# Altium schematic sheet 01.SchDoc
size A4
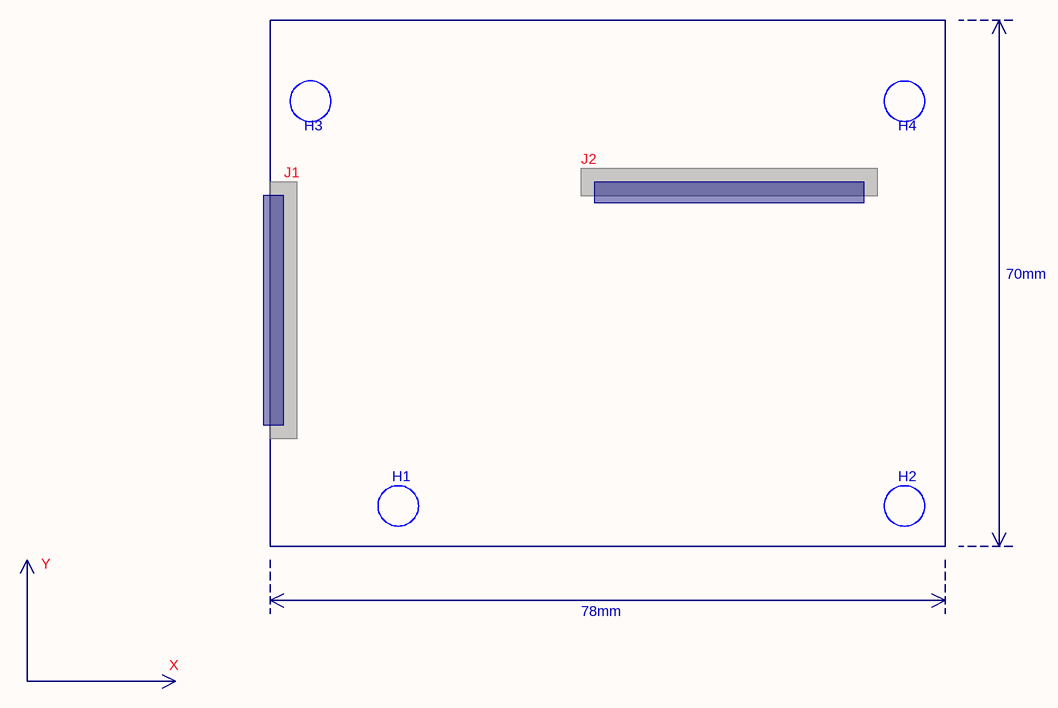
[diagram p0: 01.SchDoc]

## Notes on the sheet
- J1
- H3
- J2
- H4
- 70mm
- H1
- H2
- Y
- 78mm
- X